# EAGLE schematic mattduino_mega (EAGLE 8.6.1)

## Sheet 1 of 4: CPU
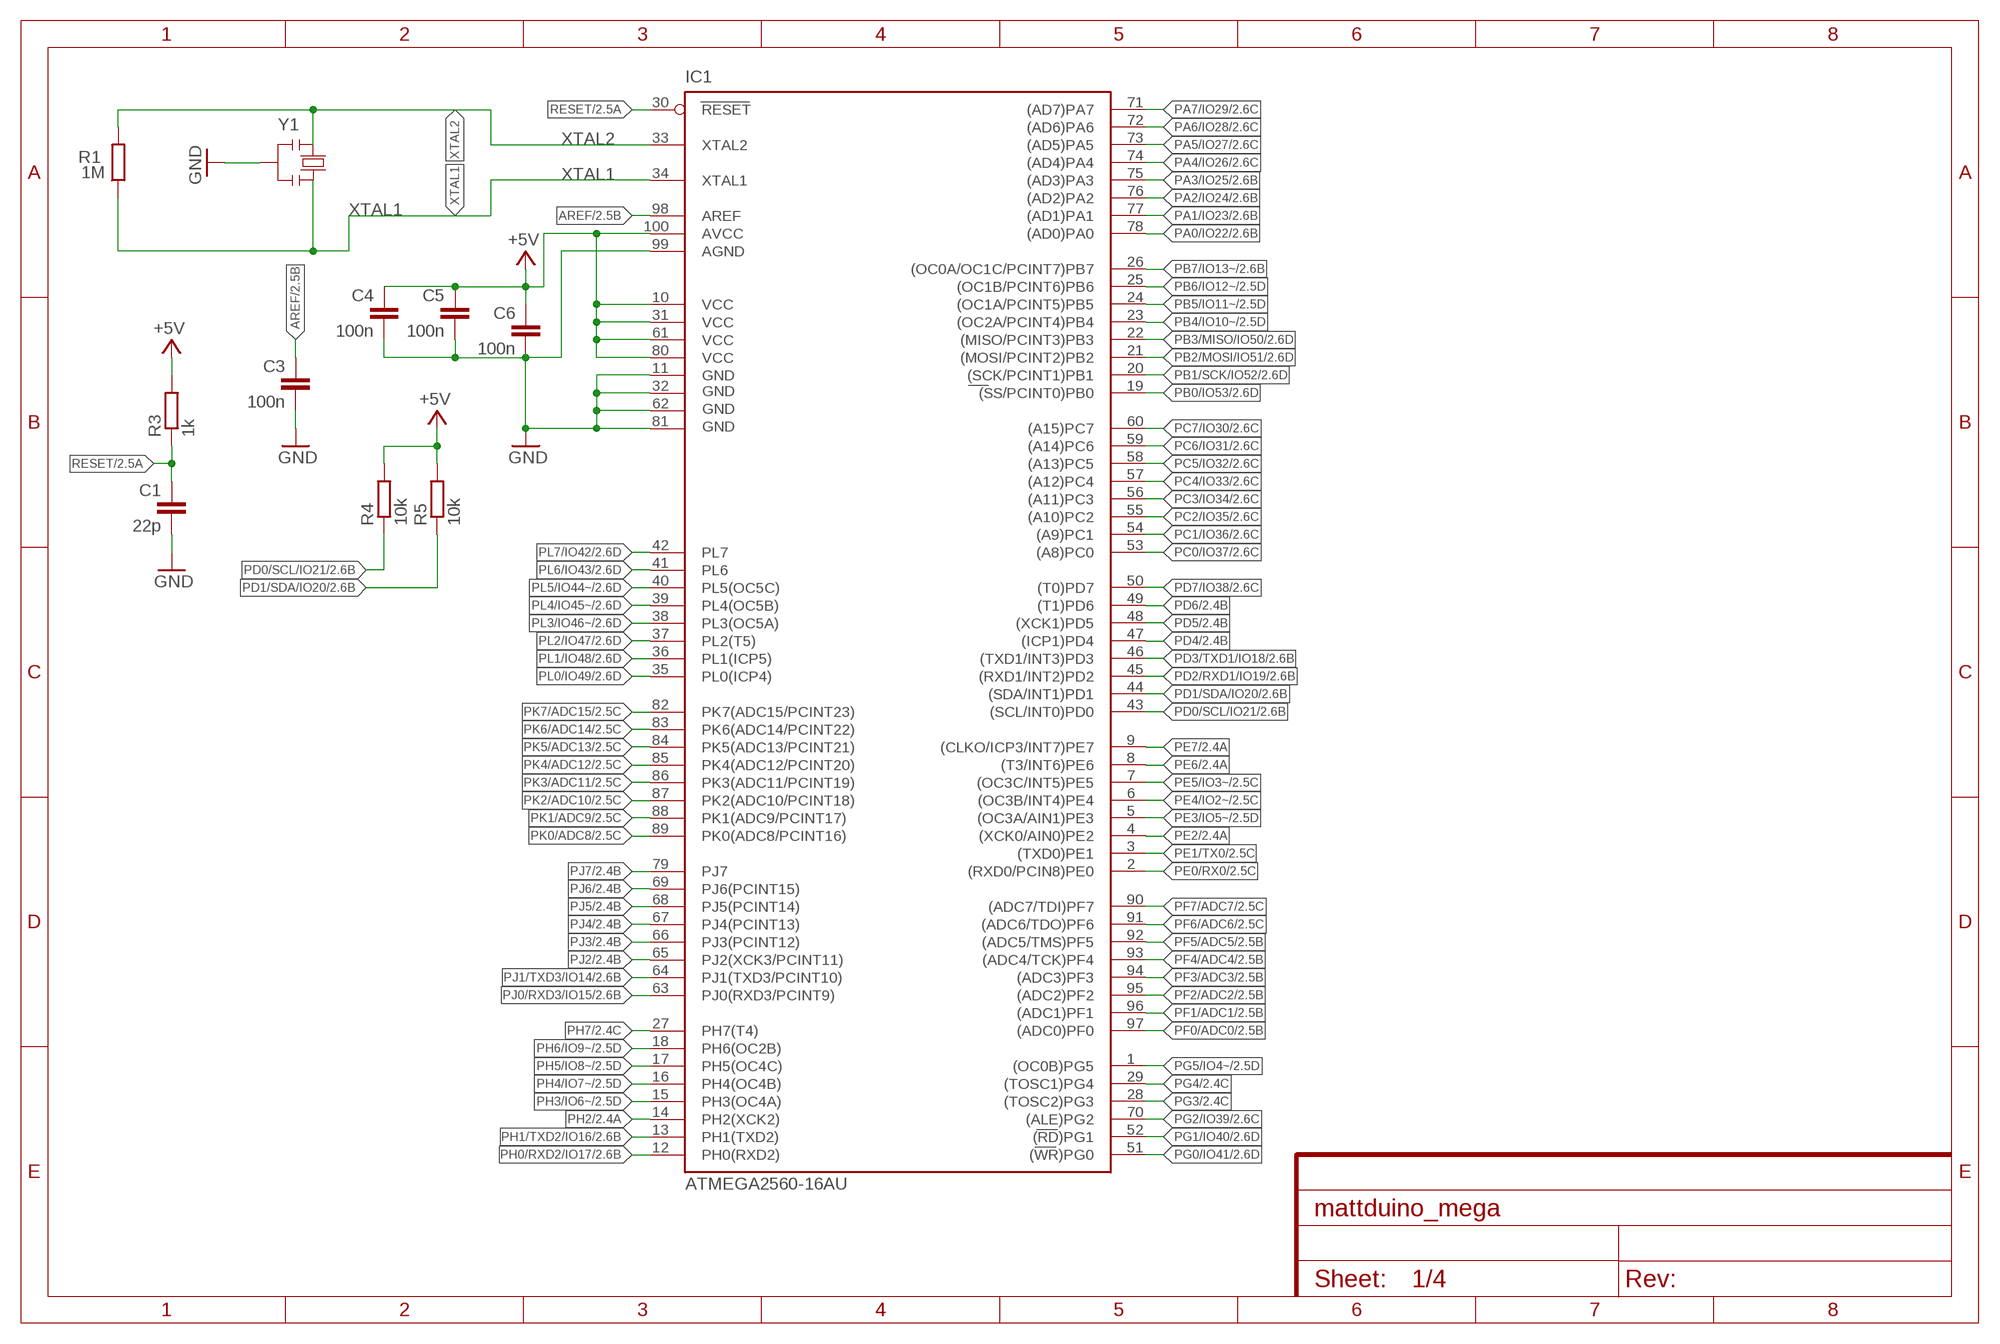
[diagram p0: schematic, sheet 1]

### Parts
C1  22p  C-EUC1206  [C1206]
C3  100n  C-EUC1206  [C1206]
C4  100n  C-EUC1206  [C1206]
C5  100n  C-EUC1206  [C1206]
C6  100n  C-EUC1206  [C1206]
IC1  ATMEGA2560-16AU  ATMEGA25602560-16AU  [TQFP100]
R1  1M  R-EU_R1206  [R1206]
R3  1k  R-EU_R1206  [R1206]
R4  10k  R-EU_R1206  [R1206]
R5  10k  R-EU_R1206  [R1206]
Y1  CSTCE16M0V53-R0 16MHZ  RESONATORMU  [RESONATOR]

### Nets
+5V [power usb]: C4.1 C5.1 C6.1 IC1.10(VCC) IC1.31(VCC1) IC1.61(VCC2) IC1.80(VCC3) IC1.100(AVCC) R3.2 R4.2 R5.2 ; also sheet 2,3,4
AREF: C3.1 IC1.98(AREF) ; also sheet 2
GND [gnd]: C1.2 C3.2 C4.2 C5.2 C6.2 IC1.11(GND) IC1.32(GND1) IC1.62(GND2) IC1.81(GND3) IC1.99(AGND) Y1.2 ; also sheet 2,3,4
PA0/IO22: IC1.78((AD0)PA0) ; also sheet 2
PA1/IO23: IC1.77((AD1)PA1) ; also sheet 2
PA2/IO24: IC1.76((AD2)PA2) ; also sheet 2
PA3/IO25: IC1.75((AD3)PA3) ; also sheet 2
PA4/IO26: IC1.74((AD4)PA4) ; also sheet 2
PA5/IO27: IC1.73((AD5)PA5) ; also sheet 2
PA6/IO28: IC1.72((AD6)PA6) ; also sheet 2
PA7/IO29: IC1.71((AD7)PA7) ; also sheet 2
PB0/IO53: IC1.19((SS/PCINT0)PB0) ; also sheet 2
PB1/SCK/IO52: IC1.20((SCK/PCINT1)PB1) ; also sheet 2
PB2/MOSI/IO51: IC1.21((MOSI/PCINT2)PB2) ; also sheet 2
PB3/MISO/IO50: IC1.22((MISO/PCINT3)PB3) ; also sheet 2
PB4/IO10~: IC1.23((OC2A/PCINT4)PB4) ; also sheet 2
PB5/IO11~: IC1.24((OC1A/PCINT5)PB5) ; also sheet 2
PB6/IO12~: IC1.25((OC1B/PCINT6)PB6) ; also sheet 2
PB7/IO13~: IC1.26((OC0A/OC1C/PCINT7)PB7) ; also sheet 2
PC0/IO37: IC1.53((A8)PC0) ; also sheet 2
PC1/IO36: IC1.54((A9)PC1) ; also sheet 2
PC2/IO35: IC1.55((A10)PC2) ; also sheet 2
PC3/IO34: IC1.56((A11)PC3) ; also sheet 2
PC4/IO33: IC1.57((A12)PC4) ; also sheet 2
PC5/IO32: IC1.58((A13)PC5) ; also sheet 2
PC6/IO31: IC1.59((A14)PC6) ; also sheet 2
PC7/IO30: IC1.60((A15)PC7) ; also sheet 2
PD0/SCL/IO21: IC1.43((SCL/INT0)PD0) R4.1 ; also sheet 2
PD1/SDA/IO20: IC1.44((SDA/INT1)PD1) R5.1 ; also sheet 2
PD2/RXD1/IO19: IC1.45((RXD1/INT2)PD2) ; also sheet 2
PD3/TXD1/IO18: IC1.46((TXD1/INT3)PD3) ; also sheet 2
PD4: IC1.47((ICP1)PD4) ; also sheet 2
PD5: IC1.48((XCK1)PD5) ; also sheet 2
PD6: IC1.49((T1)PD6) ; also sheet 2
PD7/IO38: IC1.50((T0)PD7) ; also sheet 2
PE0/RX0: IC1.2((RXD0/PCIN8)PE0) ; also sheet 2,4
PE1/TX0: IC1.3((TXD0)PE1) ; also sheet 2,4
PE2: IC1.4((XCK0/AIN0)PE2) ; also sheet 2
PE3/IO5~: IC1.5((OC3A/AIN1)PE3) ; also sheet 2
PE4/IO2~: IC1.6((OC3B/INT4)PE4) ; also sheet 2
PE5/IO3~: IC1.7((OC3C/INT5)PE5) ; also sheet 2
PE6: IC1.8((T3/INT6)PE6) ; also sheet 2
PE7: IC1.9((CLKO/ICP3/INT7)PE7) ; also sheet 2
PF0/ADC0: IC1.97((ADC0)PF0) ; also sheet 2
PF1/ADC1: IC1.96((ADC1)PF1) ; also sheet 2
PF2/ADC2: IC1.95((ADC2)PF2) ; also sheet 2
PF3/ADC3: IC1.94((ADC3)PF3) ; also sheet 2
PF4/ADC4: IC1.93((ADC4/TCK)PF4) ; also sheet 2
PF5/ADC5: IC1.92((ADC5/TMS)PF5) ; also sheet 2
PF6/ADC6: IC1.91((ADC6/TDO)PF6) ; also sheet 2
PF7/ADC7: IC1.90((ADC7/TDI)PF7) ; also sheet 2
PG0/IO41: IC1.51((WR)PG0) ; also sheet 2
PG1/IO40: IC1.52((RD)PG1) ; also sheet 2
PG2/IO39: IC1.70((ALE)PG2) ; also sheet 2
PG3: IC1.28((TOSC2)PG3) ; also sheet 2
PG4: IC1.29((TOSC1)PG4) ; also sheet 2
PG5/IO4~: IC1.1((OC0B)PG5) ; also sheet 2
PH0/RXD2/IO17: IC1.12(PH0(RXD2)) ; also sheet 2
PH1/TXD2/IO16: IC1.13(PH1(TXD2)) ; also sheet 2
PH2: IC1.14(PH2(XCK2)) ; also sheet 2
PH3/IO6~: IC1.15(PH3(OC4A)) ; also sheet 2
PH4/IO7~: IC1.16(PH4(OC4B)) ; also sheet 2
PH5/IO8~: IC1.17(PH5(OC4C)) ; also sheet 2
PH6/IO9~: IC1.18(PH6(OC2B)) ; also sheet 2
PH7: IC1.27(PH7(T4)) ; also sheet 2
PJ0/RXD3/IO15: IC1.63(PJ0(RXD3/PCINT9)) ; also sheet 2
PJ1/TXD3/IO14: IC1.64(PJ1(TXD3/PCINT10)) ; also sheet 2
PJ2: IC1.65(PJ2(XCK3/PCINT11)) ; also sheet 2
PJ3: IC1.66(PJ3(PCINT12)) ; also sheet 2
PJ4: IC1.67(PJ4(PCINT13)) ; also sheet 2
PJ5: IC1.68(PJ5(PCINT14)) ; also sheet 2
PJ6: IC1.69(PJ6(PCINT15)) ; also sheet 2
PJ7: IC1.79(PJ7) ; also sheet 2
PK0/ADC8: IC1.89(PK0(ADC8/PCINT16)) ; also sheet 2
PK1/ADC9: IC1.88(PK1(ADC9/PCINT17)) ; also sheet 2
PK2/ADC10: IC1.87(PK2(ADC10/PCINT18)) ; also sheet 2
PK3/ADC11: IC1.86(PK3(ADC11/PCINT19)) ; also sheet 2
PK4/ADC12: IC1.85(PK4(ADC12/PCINT20)) ; also sheet 2
PK5/ADC13: IC1.84(PK5(ADC13/PCINT21)) ; also sheet 2
PK6/ADC14: IC1.83(PK6(ADC14/PCINT22)) ; also sheet 2
PK7/ADC15: IC1.82(PK7(ADC15/PCINT23)) ; also sheet 2
PL0/IO49: IC1.35(PL0(ICP4)) ; also sheet 2
PL1/IO48: IC1.36(PL1(ICP5)) ; also sheet 2
PL2/IO47: IC1.37(PL2(T5)) ; also sheet 2
PL3/IO46~: IC1.38(PL3(OC5A)) ; also sheet 2
PL4/IO45~: IC1.39(PL4(OC5B)) ; also sheet 2
PL5/IO44~: IC1.40(PL5(OC5C)) ; also sheet 2
PL6/IO43: IC1.41(PL6) ; also sheet 2
PL7/IO42: IC1.42(PL7) ; also sheet 2
RESET: C1.1 IC1.30(RESET) R3.1 ; also sheet 2,4
XTAL1: IC1.34(XTAL1) R1.1 Y1.3
XTAL2: IC1.33(XTAL2) R1.2 Y1.1

## Sheet 2 of 4: PINOUT
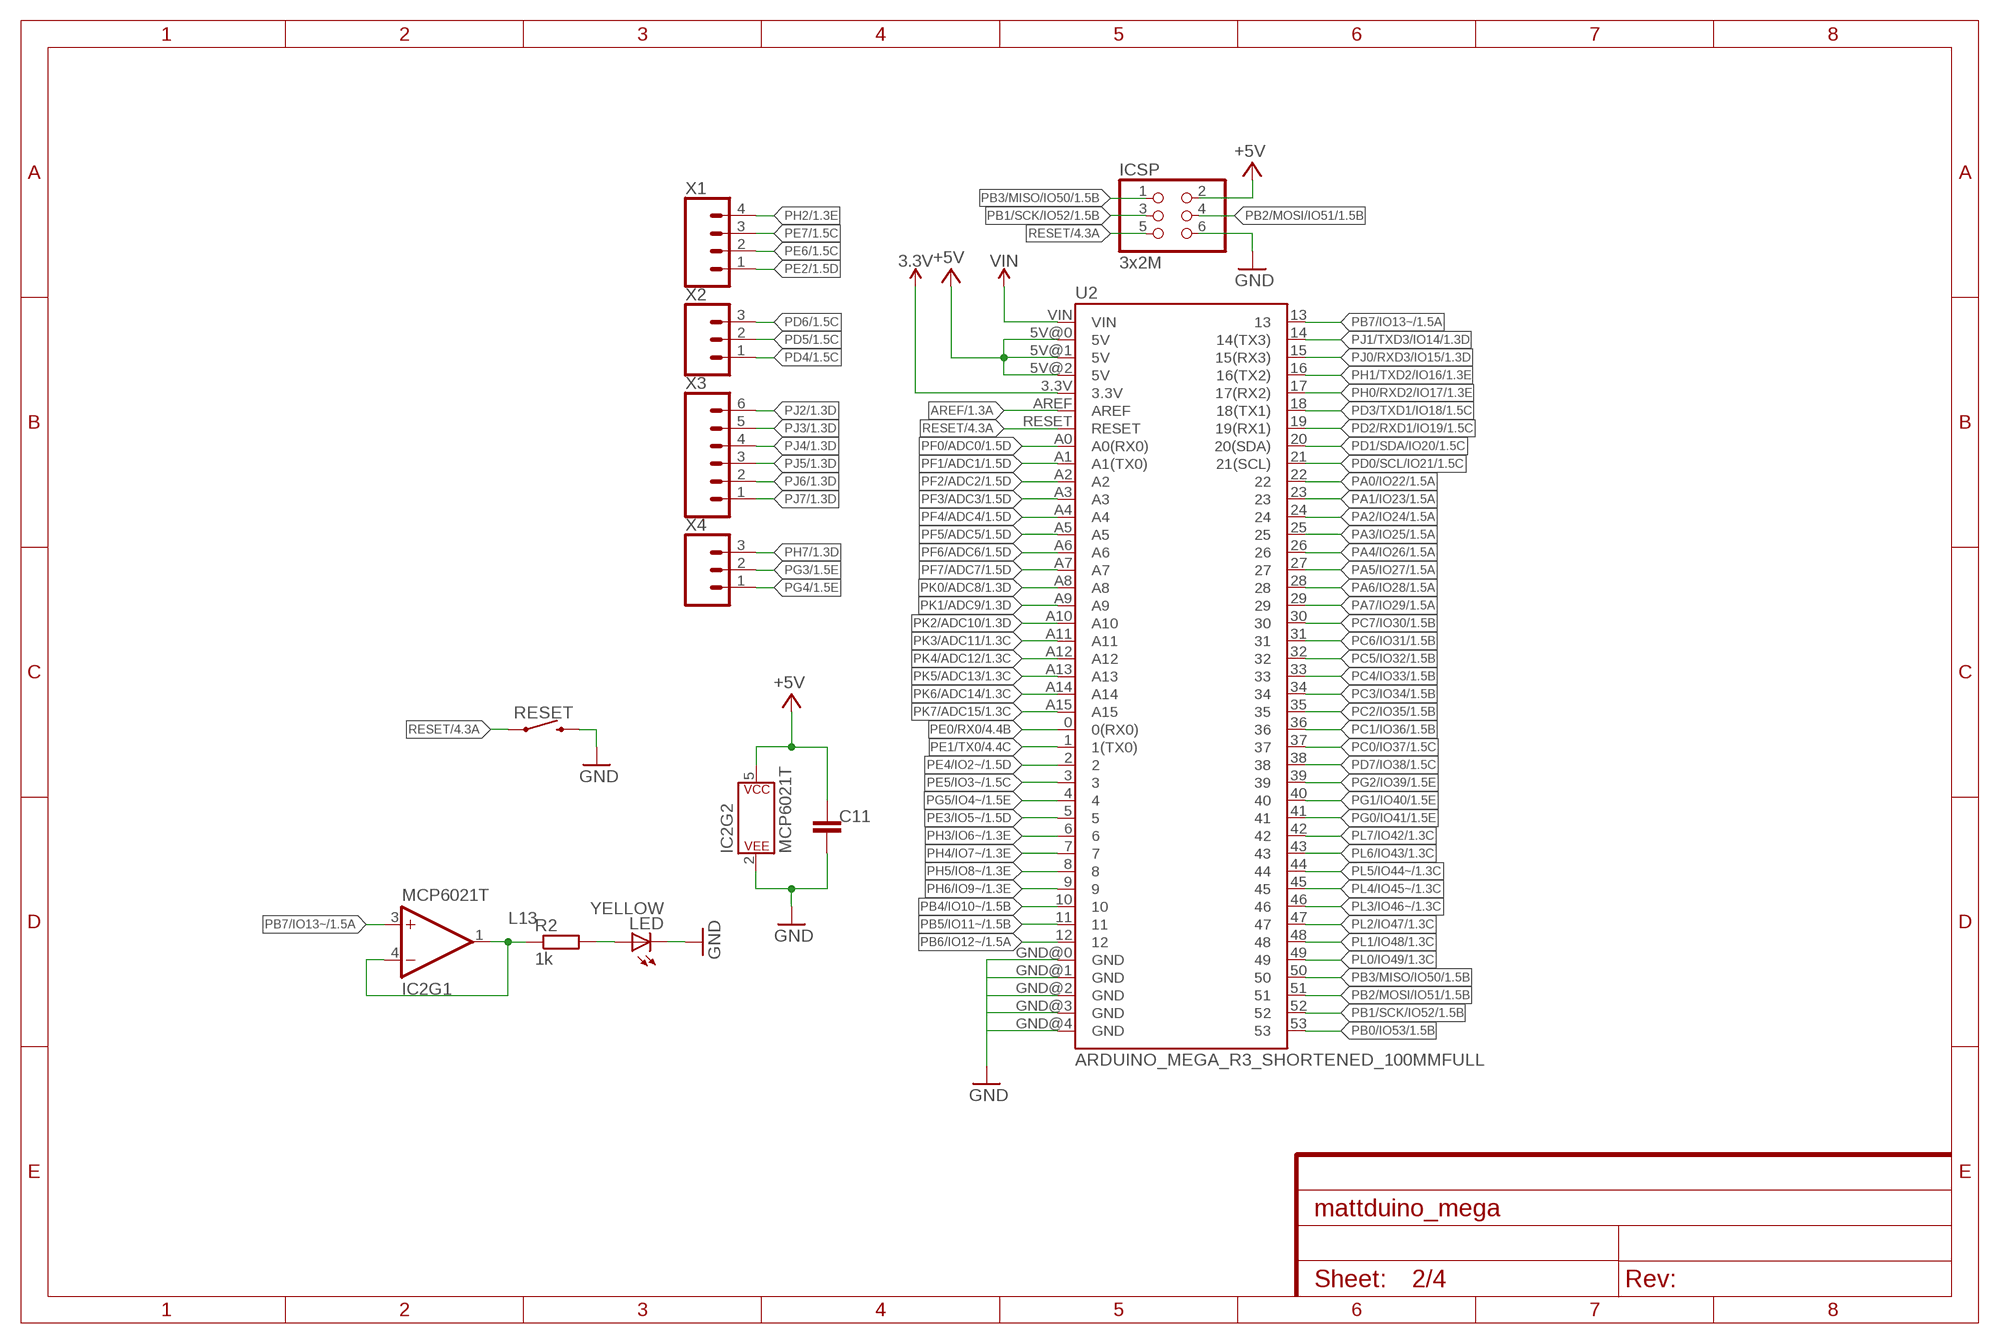
[diagram p1: schematic, sheet 2]

### Parts
C11  100n  C-EUC1206  [C1206]
IC2  MCP6021T  MCP6021T-E/OT  [SOT23-5]
ICSP  3x2M  PINHD-2X3  [2X03]
LED  YELLOW  LEDCHIP-LED0805  [CHIP-LED0805]
R2  1k  R-EU_R1206  [R1206]
RESET  MOMENTARY-SWITCH-SPST-PTH-6.0MM  [TACTILE_SWITCH_PTH_6.0MM]
U2  ARDUINO_MEGA_R3_SHORTENED_100MMFULL  [ARDUINO_MEGA_SHORTENED_100MM]
X1  CONN_04  [1X04]
X2  CONN_03  [1X03]
X3  CONN_06SILK_FEMALE_PTH  [1X06]
X4  CONN_03  [1X03]

### Nets
3.3V: U2.3.3V ; also sheet 3,4
+5V [power usb]: C11.2 IC2.5(P$V+) ICSP.2 U2.5V@0(5V) U2.5V@1(5V) U2.5V@2(5V) ; also sheet 1,3,4
AREF: U2.AREF ; also sheet 1
GND [gnd]: C11.1 IC2.2(P$V-) ICSP.6 LED.C RESET.3 U2.GND@0(GND) U2.GND@1(GND) U2.GND@2(GND) U2.GND@3(GND) U2.GND@4(GND) ; also sheet 1,3,4
L13: IC2.1(OUT) IC2.4(-IN) R2.1
N$2: LED.A R2.2
PA0/IO22: U2.22 ; also sheet 1
PA1/IO23: U2.23 ; also sheet 1
PA2/IO24: U2.24 ; also sheet 1
PA3/IO25: U2.25 ; also sheet 1
PA4/IO26: U2.26 ; also sheet 1
PA5/IO27: U2.27 ; also sheet 1
PA6/IO28: U2.28 ; also sheet 1
PA7/IO29: U2.29 ; also sheet 1
PB0/IO53: U2.53 ; also sheet 1
PB1/SCK/IO52: ICSP.3 U2.52 ; also sheet 1
PB2/MOSI/IO51: ICSP.4 U2.51 ; also sheet 1
PB3/MISO/IO50: ICSP.1 U2.50 ; also sheet 1
PB4/IO10~: U2.10 ; also sheet 1
PB5/IO11~: U2.11 ; also sheet 1
PB6/IO12~: U2.12 ; also sheet 1
PB7/IO13~: IC2.3(+IN) U2.13 ; also sheet 1
PC0/IO37: U2.37 ; also sheet 1
PC1/IO36: U2.36 ; also sheet 1
PC2/IO35: U2.35 ; also sheet 1
PC3/IO34: U2.34 ; also sheet 1
PC4/IO33: U2.33 ; also sheet 1
PC5/IO32: U2.32 ; also sheet 1
PC6/IO31: U2.31 ; also sheet 1
PC7/IO30: U2.30 ; also sheet 1
PD0/SCL/IO21: U2.21(21(SCL)) ; also sheet 1
PD1/SDA/IO20: U2.20(20(SDA)) ; also sheet 1
PD2/RXD1/IO19: U2.19(19(RX1)) ; also sheet 1
PD3/TXD1/IO18: U2.18(18(TX1)) ; also sheet 1
PD4: X2.1 ; also sheet 1
PD5: X2.2 ; also sheet 1
PD6: X2.3 ; also sheet 1
PD7/IO38: U2.38 ; also sheet 1
PE0/RX0: U2.0(0(RX0)) ; also sheet 1,4
PE1/TX0: U2.1(1(TX0)) ; also sheet 1,4
PE2: X1.1 ; also sheet 1
PE3/IO5~: U2.5 ; also sheet 1
PE4/IO2~: U2.2 ; also sheet 1
PE5/IO3~: U2.3 ; also sheet 1
PE6: X1.2 ; also sheet 1
PE7: X1.3 ; also sheet 1
PF0/ADC0: U2.A0(A0(RX0)) ; also sheet 1
PF1/ADC1: U2.A1(A1(TX0)) ; also sheet 1
PF2/ADC2: U2.A2 ; also sheet 1
PF3/ADC3: U2.A3 ; also sheet 1
PF4/ADC4: U2.A4 ; also sheet 1
PF5/ADC5: U2.A5 ; also sheet 1
PF6/ADC6: U2.A6 ; also sheet 1
PF7/ADC7: U2.A7 ; also sheet 1
PG0/IO41: U2.41 ; also sheet 1
PG1/IO40: U2.40 ; also sheet 1
PG2/IO39: U2.39 ; also sheet 1
PG3: X4.2 ; also sheet 1
PG4: X4.1 ; also sheet 1
PG5/IO4~: U2.4 ; also sheet 1
PH0/RXD2/IO17: U2.17(17(RX2)) ; also sheet 1
PH1/TXD2/IO16: U2.16(16(TX2)) ; also sheet 1
PH2: X1.4 ; also sheet 1
PH3/IO6~: U2.6 ; also sheet 1
PH4/IO7~: U2.7 ; also sheet 1
PH5/IO8~: U2.8 ; also sheet 1
PH6/IO9~: U2.9 ; also sheet 1
PH7: X4.3 ; also sheet 1
PJ0/RXD3/IO15: U2.15(15(RX3)) ; also sheet 1
PJ1/TXD3/IO14: U2.14(14(TX3)) ; also sheet 1
PJ2: X3.6 ; also sheet 1
PJ3: X3.5 ; also sheet 1
PJ4: X3.4 ; also sheet 1
PJ5: X3.3 ; also sheet 1
PJ6: X3.2 ; also sheet 1
PJ7: X3.1 ; also sheet 1
PK0/ADC8: U2.A8 ; also sheet 1
PK1/ADC9: U2.A9 ; also sheet 1
PK2/ADC10: U2.A10 ; also sheet 1
PK3/ADC11: U2.A11 ; also sheet 1
PK4/ADC12: U2.A12 ; also sheet 1
PK5/ADC13: U2.A13 ; also sheet 1
PK6/ADC14: U2.A14 ; also sheet 1
PK7/ADC15: U2.A15 ; also sheet 1
PL0/IO49: U2.49 ; also sheet 1
PL1/IO48: U2.48 ; also sheet 1
PL2/IO47: U2.47 ; also sheet 1
PL3/IO46~: U2.46 ; also sheet 1
PL4/IO45~: U2.45 ; also sheet 1
PL5/IO44~: U2.44 ; also sheet 1
PL6/IO43: U2.43 ; also sheet 1
PL7/IO42: U2.42 ; also sheet 1
RESET: ICSP.5 RESET.1 U2.RESET ; also sheet 1,4
VIN: U2.VIN ; also sheet 3

## Sheet 3 of 4: Power
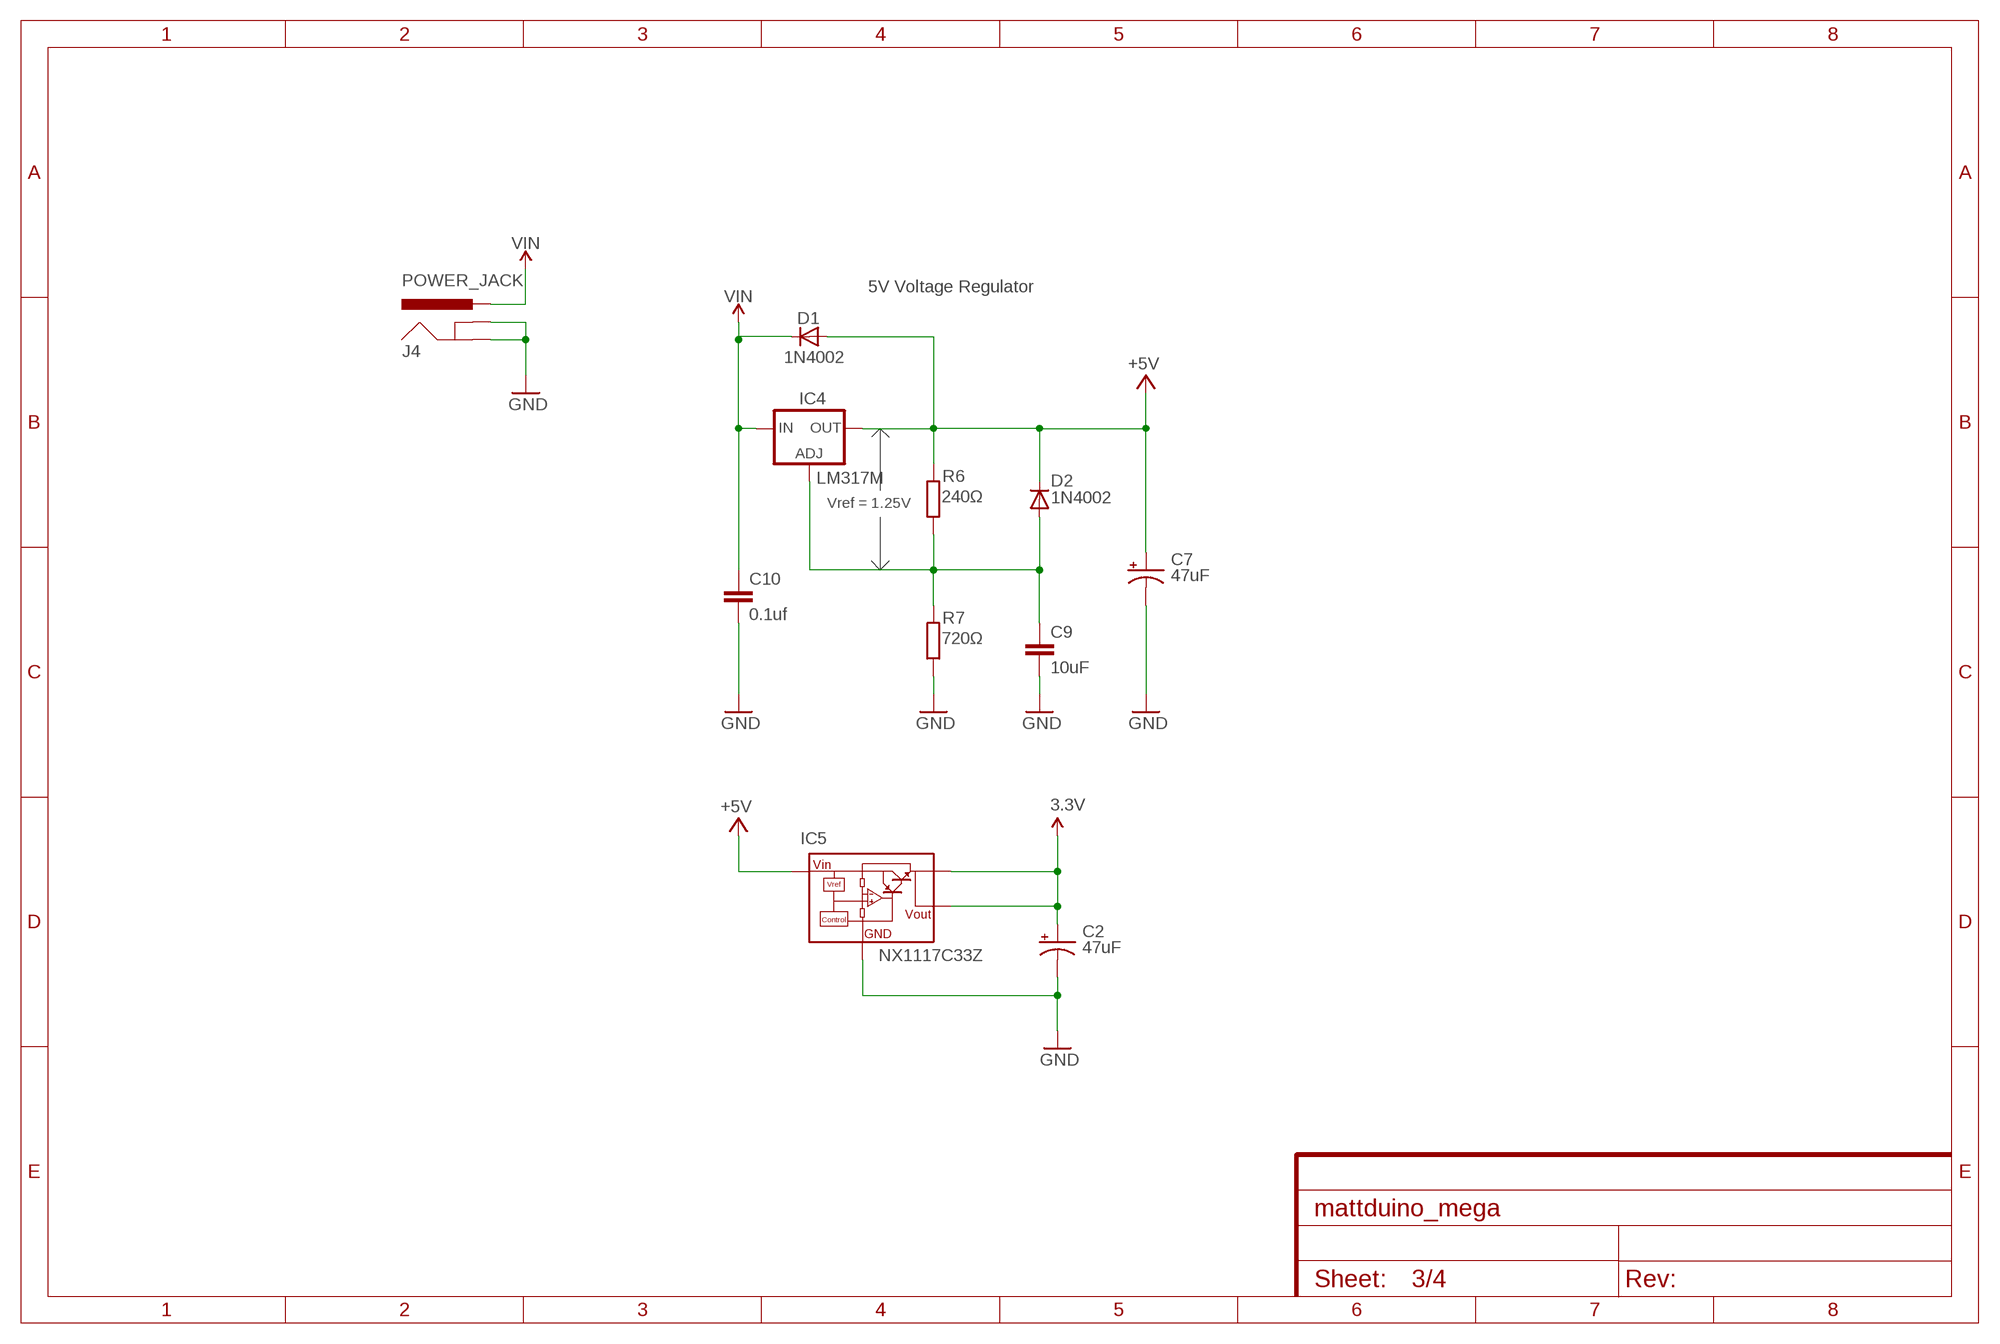
[diagram p2: schematic, sheet 3]

### Parts
C2  47uF  47UF-POLAR-PANASONIC_D-35V-20%  [PANASONIC_D]
C7  47uF  47UF-POLAR-PANASONIC_D-35V-20%  [PANASONIC_D]
C9  10uF  C-EUC1206  [C1206]
C10  0.1uf  C-EUC1206  [C1206]
D1  1N4002  DIODESOD-123  [SOD-123]
D2  1N4002  DIODESOD-123  [SOD-123]
IC4  LM317MBSTT3  [SOT223]
IC5  NX1117C33Z  [SOT223]
J4  POWER_JACK  [POWER_JACK_PTH]
R6  240Ω  R-EU_R1206  [R1206]
R7  720Ω  R-EU_R1206  [R1206]

### Nets
3.3V: C2.+ IC5.2(VOUT1) IC5.4(VOUT) ; also sheet 2,4
+5V [power usb]: C7.+ D1.A D2.C IC4.4(OUT) IC5.3(VIN) R6.2 ; also sheet 1,2,4
GND [gnd]: C2.- C7.- C9.2 C10.2 IC5.1(GND) J4.GND J4.GNDBREAK R7.1 ; also sheet 1,2,4
N$1: C9.1 D2.A IC4.1(ADJ) R6.1 R7.2
VIN: C10.1 D1.C IC4.3(IN) J4.PWR ; also sheet 2

### Notes on the sheet
- 5V Voltage Regulator
- Vref = 1.25V

## Sheet 4 of 4: Programmer
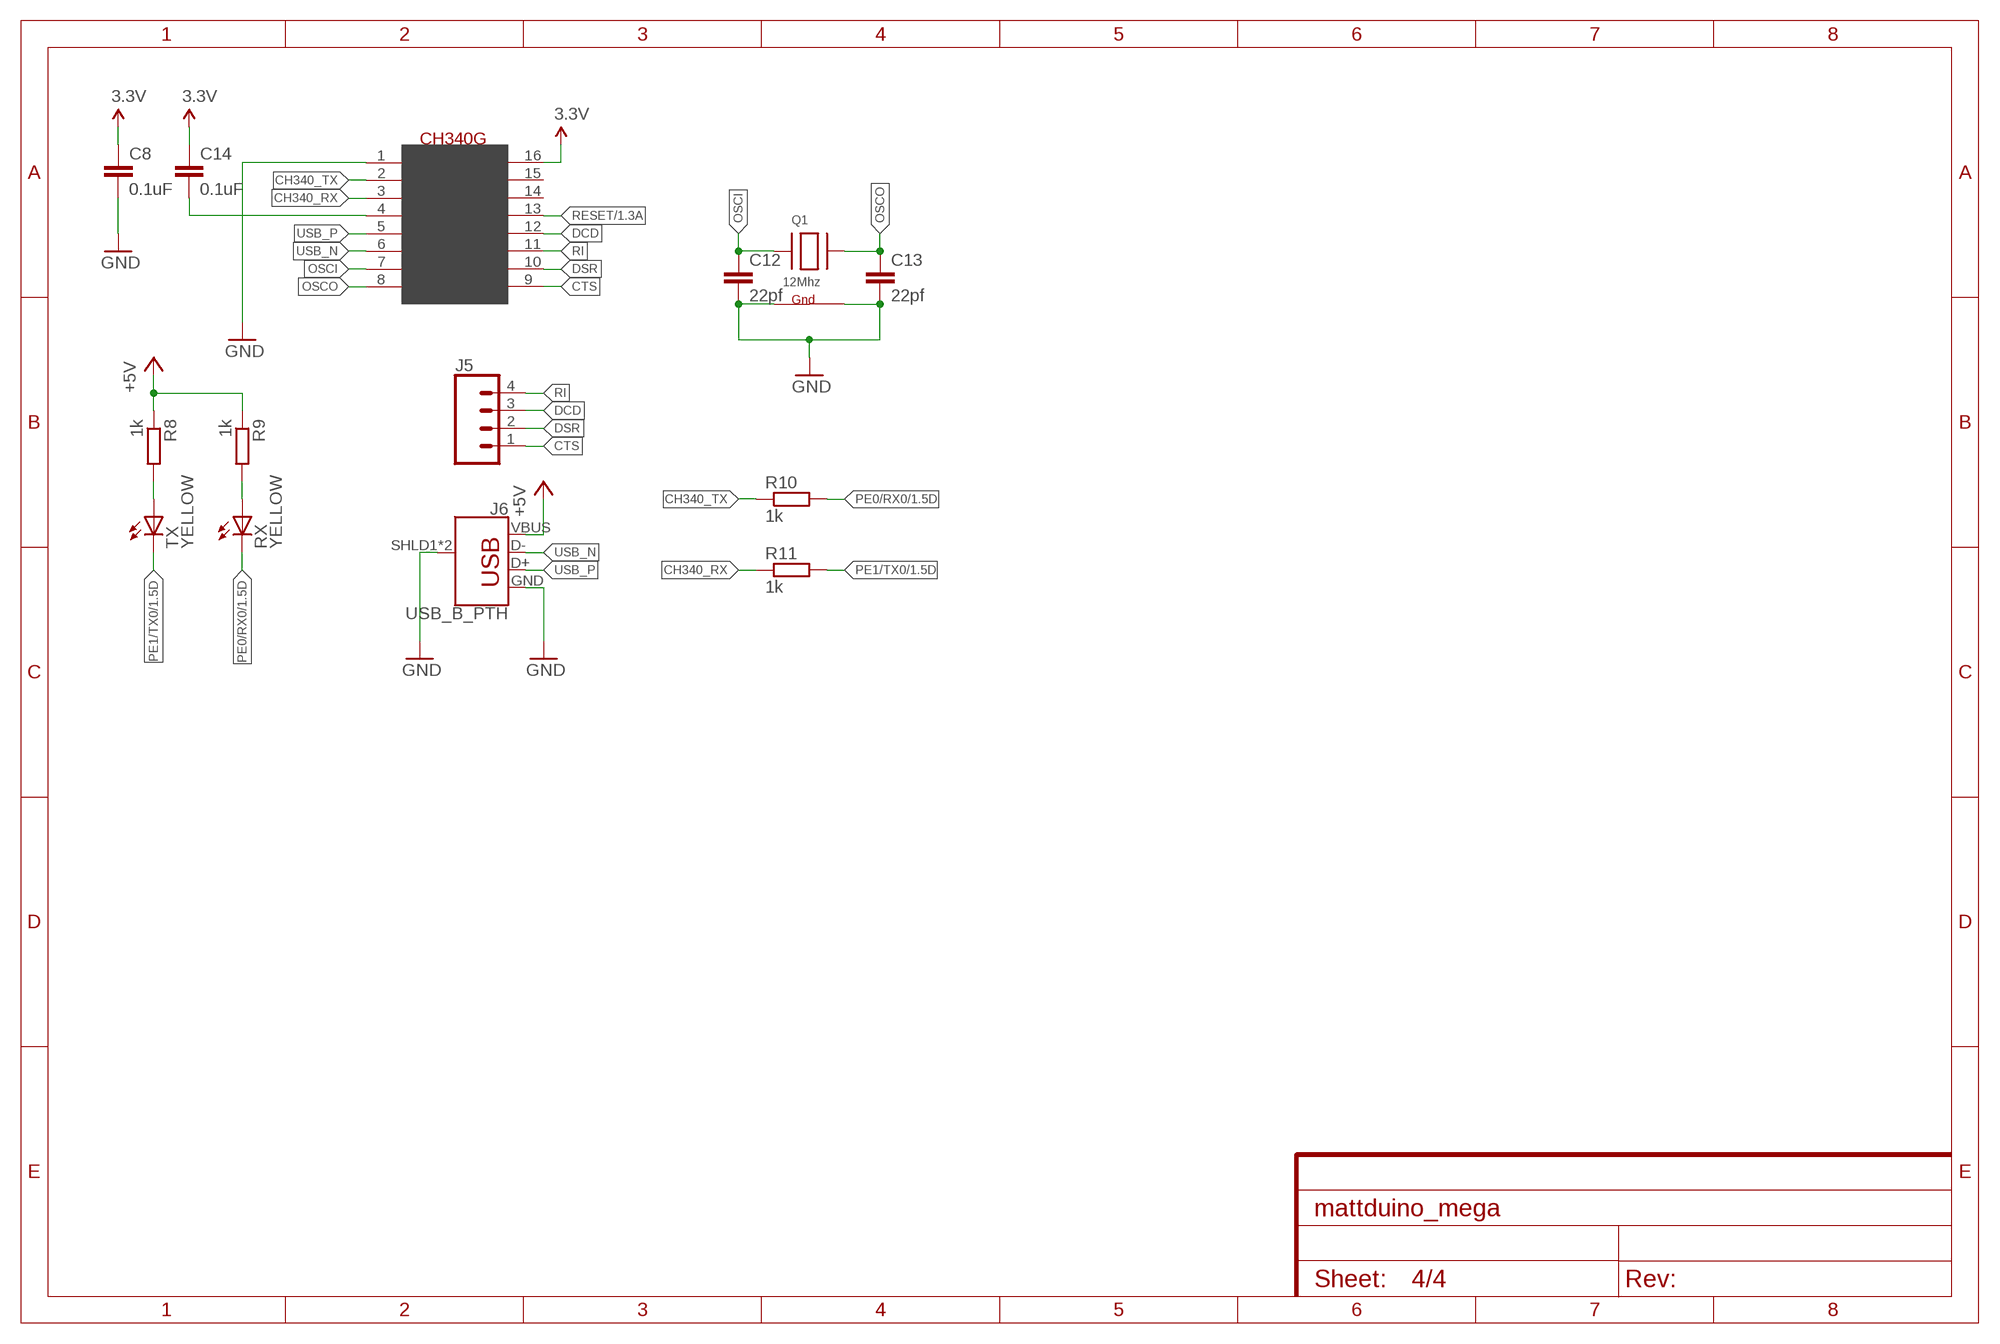
[diagram p3: schematic, sheet 4]

### Parts
C8  0.1uF  C-EUC1206  [C1206]
C12  22pf  C-EUC1206  [C1206]
C13  22pf  C-EUC1206  [C1206]
C14  0.1uF  C-EUC1206  [C1206]
IC3  CH340G  [SOIC16]
J5  CONN_04  [1X04]
J6  USB_B_PTH  [USB-B-PTH]
Q1  12Mhz  XTAL-4-3225  [NX3225]
R8  1k  R-EU_R1206  [R1206]
R9  1k  R-EU_R1206  [R1206]
R10  1k  R-EU_R1206  [R1206]
R11  1k  R-EU_R1206  [R1206]
RX  YELLOW  LEDCHIP-LED0805  [CHIP-LED0805]
TX  YELLOW  LEDCHIP-LED0805  [CHIP-LED0805]

### Nets
3.3V: C8.1 C14.1 IC3.16(VCC) ; also sheet 2,3
+5V [power usb]: J6.VBUS R8.1 R9.1 ; also sheet 1,2,3
CH340_RX: IC3.3(RX) R11.1
CH340_TX: IC3.2(TX) R10.1
CTS: IC3.9(CTS) J5.1
DCD: IC3.12(DCD) J5.3
DSR: IC3.10(DSR) J5.2
GND [gnd]: C8.2 C12.2 C13.2 IC3.1(GND) J6.GND J6.SHLD1(SHIELD) J6.SHLD2(SHIELD) Q1.2(G2) Q1.4(G1) ; also sheet 1,2,3
N$3: C14.2 IC3.4(V3)
N$5: R8.2 TX.A
N$6: R9.2 RX.A
OSCI: C12.1 IC3.7(XI) Q1.1(X1)
OSCO: C13.1 IC3.8(XO) Q1.3(X2)
PE0/RX0: R10.2 RX.C ; also sheet 1,2
PE1/TX0: R11.2 TX.C ; also sheet 1,2
RESET: IC3.13(DTR) ; also sheet 1,2
RI: IC3.11(RI) J5.4
USB_N: IC3.6(D-) J6.D-
USB_P: IC3.5(D+) J6.D+
Unconnected: IC3.14(RTS) IC3.15(RS232)

## Library data of the parts
C1 C3-C6 C8-C11 C14 = rcl:C-EU: CAPACITOR, European symbol; SPICEPREFIX: C
C2 C7 = SparkFun-Capacitors:47UF-POLAR: 47µF polarized capacitors A capacitor is a passive two-terminal electrical component used to store electrical energy temporarily in an electric field.; PROD_ID: CAP-08478
C12 C13 = rcl:C-EU: CAPACITOR, European symbol
D1 D2 = adafruit:DIODE: Diode SMADIODE - SMA Surface Mount Package 20V 1A Schottky Diode Digikey: 641-1014-6-ND DO-1N4148 - Through Hole Small Current Diode SOD-123 20V 1 A (.5mV Vf) Schottky Diode - Digikey: MBRX120TPMSCT-ND SOD-323 10V 570mA (.38mV Vf, 3ns) Schottky Diode - Digikey: ZLLS410CT-ND SOD-523 30V 30mA Schottky Diode (RB751S-40TE61) - Digikey: RB751S-40TE61CT-ND SOT23-R/W - SOT23 Package (R = Solder Paste/Reflow Ovens, W = Hand-Soldering) BAT54Film 40V 300mA - Digikey: 497-7162-1-ND
IC1 = SmartPrj:ATMEGA2560: MICROCONTROLLER 64/128/256 Kbytes FLASH 4 Kbytes EEPROM 8 Kbytes SRAM 86 General Purpose I/O pins 12-channels16-bit PWM 4 x Serial USARTs 16-channels 10-bit A/D
IC2 = SparkFun-IC-Amplifiers:MCP6021: MCP6021T-E/OT OP AMP Rail-to-rail input/output op-amp with 10 MHz bandwidth. SparkFun Products ZX Distance and Gesture Sensor <https://www.sparkfun.com/products/12780> (SEN-12780); PROD_ID: IC-12504
IC3 = CH340G-USB-SERIAL:CH340G
IC4 = v-reg:LM317?*: 500 mA Adjustable Output Positive Voltage Regulator Source: http://www.onsemi.co.jp .. LM317M-D.PDF; PARTNUMBER: LM317M
IC5 = nxp_60:NX1117C: The NX1117C/NX1117CE are two series of low-dropout positive voltage regulators with an output current capability of 1 A. AAL Eindhoven MK; 12NC: 9352 914 42115; TOLERANCE: 1.25%; VOLTAGE: 5.0V
ICSP = SmartPrj:PINHD-2X3: PIN HEADER
J4 = SparkFun-Connectors:POWER_JACK: Power Jack Connector This is the standard 5.5mm barrel jack for power. The PTH is the most common, proven, reliable, footprint. The Slot footprint only works if the mill layer is transmitted to the PCB fab house so be warned. Here are the connectors we sell at SparkFun: DC Barrel Power Jack/Connector <https://www.sparkfun.com/products/119> (PRT-00119) DC Barrel Power Jack/Connector (SMD) <https://www.sparkfun.com/products/12748> (PRT-12748) DC Barrel Jack Adapter - Breadboard Compatible <https://www.sparkfun.com/products/10811> (PRT-10811) It is used on this SparkFun product (and many, many others): SparkFun RedBoard - Programmed with Arduino <https://www.sparkfun.com/products/12757> (DEV-12757) Also, if you need a mating power supply or connector, please check these out: Wall Adapter Power Supply - 9VDC 650mA <https://www.sparkfun.com/products/298> (TOL-00298) DC Barrel Jack Adapter - Male <https://www.sparkfun.com/products/10287> (PRT-10287); PROD_ID: CONN-08197
J5 X1 = SparkFun-Connectors:CONN_04: Multi connection point. Often used as Generic Header-pin footprint for 0.1 inch spaced/style header connections On any of the 0.1 inch spaced packages, you can populate with these: Break Away Headers - Straight <https://www.sparkfun.com/products/116> (PRT-00116) Break Away Male Headers - Right Angle <https://www.sparkfun.com/products/553> (PRT-00553) Female Headers <https://www.sparkfun.com/products/115> (PRT-00115) Break Away Headers - Machine Pin <https://www.sparkfun.com/products/117> (PRT-00117) Break Away Female Headers - Swiss Machine Pin <https://www.sparkfun.com/products/743> (PRT-00743) For SCREWTERMINALS and SPRING TERMINALS visit here: Screw Terimnals on SparkFun.com <https://www.sparkfun.com/search/results?term=Screw+Terminals> (5mm/3.5mm/2.54mm spacing) This device is also useful as a general connection point to wire up your design to another part of your project. Our various solder wires solder well into these plated through hole pads. Hook-Up Wire - Assortment (Stranded, 22 AWG) <https://www.sparkfun.com/products/11375> (PRT-11375) Hook-Up Wire - Assortment (Solid Core, 22 AWG) <https://www.sparkfun.com/products/11367> (PRT-11367) View the entire wire category on our website here <https://www.sparkfun.com/categories/141> Special notes: Molex polarized connector foot print use with SKU : PRT-08231 with associated crimp pins and housings. 1MM SMD Version SKU: PRT-10208; PROD_ID: CONN-09696
J6 = SparkFun-Connectors:USB_B: USB Type B Connector SparkFun Products: SparkFun Stepoko <https://www.sparkfun.com/products/13899> PTH; PROD_ID: CONN-08278; SF_ID: PRT-00139
LED RX TX = led:LED: LED OSRAM: - CHIPLED LG R971, LG N971, LY N971, LG Q971, LY Q971, LO R971, LY R971 LH N974, LH R974 LS Q976, LO Q976, LY Q976 LO Q996 - Hyper CHIPLED LW Q18S LB Q993, LB Q99A, LB R99A - SideLED LS A670, LO A670, LY A670, LG A670, LP A670 LB A673, LV A673, LT A673, LW A673 LH A674 LY A675 LS A676, LA A676, LO A676, LY A676, LW A676 LS A679, LY A679, LG A679 - Hyper Micro SIDELED® LS Y876, LA Y876, LO Y876, LY Y876 LT Y87S - SmartLED LW L88C, LW L88S LB L89C, LB L89S, LG L890 LS L89K, LO L89K, LY L89K LS L896, LA L896, LO L896, LY L896 - TOPLED LS T670, LO T670, LY T670, LG T670, LP T670 LSG T670, LSP T670, LSY T670, LOP T670, LYG T670 LG T671, LOG T671, LSG T671 LB T673, LV T673, LT T673, LW T673 LH T674 LS T676, LA T676, LO T676, LY T676, LB T676, LH T676, LSB T676, LW T676 LB T67C, LV T67C, LT T67C, LS T67K, LO T67K, LY T67K, LW E67C LS E67B, LA E67B, LO E67B, LY E67B, LB E67C, LV E67C, LT E67C LW T67C LS T679, LY T679, LG T679 LS T770, LO T770, LY T770, LG T770, LP T770 LB T773, LV T773, LT T773, LW T773 LH T774 LS E675, LA E675, LY E675, LS T675 LS T776, LA T776, LO T776, LY T776, LB T776 LHGB T686 LT T68C, LB T68C - Hyper Mini TOPLED® LB M676 - Mini TOPLED Santana® LG M470 LS M47K, LO M47K, LY M47K Source: http://www.osram.convergy.de LUXEON: - LUMILED® LXK2-PW12-R00, LXK2-PW12-S00, LXK2-PW14-U00, LXK2-PW14-V00 LXK2-PM12-R00, LXK2-PM12-S00, LXK2-PM14-U00 LXK2-PE12-Q00, LXK2-PE12-R00, LXK2-PE12-S00, LXK2-PE14-T00, LXK2-PE14-U00 LXK2-PB12-K00, LXK2-PB12-L00, LXK2-PB12-M00, LXK2-PB14-N00, LXK2-PB14-P00, LXK2-PB14-Q00 LXK2-PR12-L00, LXK2-PR12-M00, LXK2-PR14-Q00, LXK2-PR14-R00 LXK2-PD12-Q00, LXK2-PD12-R00, LXK2-PD12-S00 LXK2-PH12-R00, LXK2-PH12-S00 LXK2-PL12-P00, LXK2-PL12-Q00, LXK2-PL12-R00 Source: www.luxeon.com KINGBRIGHT: KA-3528ASYC Source: www.kingbright.com
Q1 = adafruit:XTAL-4: Classic 4-pin 3.2 x 2.5mm crystal
R1-R11 = rcl:R-EU_: RESISTOR, European symbol; SPICEPREFIX: R
RESET = SparkFun-Switches:MOMENTARY-SWITCH-SPST: Momentary Switch (Pushbutton) - SPST Normally-open (NO) SPST momentary switches (buttons, pushbuttons). Variants PTH-12MM - 12mm square, through-hole Momentary Pushbutton Switch - 12mm Square <https://www.sparkfun.com/products/9190> (COM-09190) PTH-6.0MM, PTH-6.0MM-KIT - 6.0mm square, through-hole Mini Pushbutton Switch <https://www.sparkfun.com/products/97> (COM-00097) KIT package intended for soldering kit's - only one side of pads' copper is exposed. PTH-RIGHT-ANGLE-KIT - Right-angle, through-hole Right Angle Tactile Button <https://www.sparkfun.com/products/10791> - Used on SparkFun BigTime Watch Kit <https://www.sparkfun.com/products/11734> SMD-12MM - 12mm square, surface-mount Tactile Button - SMD (12mm) <https://www.sparkfun.com/products/12993> (COM-12993) Used on SparkFun PicoBoard <https://www.sparkfun.com/products/11888> SMD-4.5MM - 4.5mm Square Trackball Switch Used on SparkFun Blackberry Trackballer Breakout <https://www.sparkfun.com/products/13169> SMD-4.6MMX2.8MM - 4.60mm x 2.80mm, surface mount Used on SparkFun SAMD21 Mini Breakout <https://www.sparkfun.com/products/13664> SMD-5.2MM, SMD-5.2-REDUNDANT - 5.2mm square, surface-mount Mini Pushbutton Switch - SMD <https://www.sparkfun.com/products/8720> (COM-08720) Used on Arduino Pro Mini <https://www.sparkfun.com/products/11114> REDUNDANT package connects both switch circuits together SMD-6.0X3.5MM - 6.0 x 3.5mm, surface mount Momentary Reset Switch SMD <https://www.sparkfun.com/products/8229> (COM-08229) SMD-6.2MM-TALL - 6.2mm square, surface mount Tactile Button - SMD (6mm) <https://www.sparkfun.com/products/12992> Used on SparkFun Digital Sandbox <https://www.sparkfun.com/products/12651> SMD-RIGHT-ANGLE - Right-angle, surface mount Used on SparkFun Block for Intel® Edison - Arduino <https://www.sparkfun.com/products/13036>; PROD_ID: SWCH-08441; SF_SKU: COM-00097
U2 = Arduino_Mega_Shortened:ARDUINO_MEGA_R3_SHORTENED_100MM: Arduino Mega R3 ATmega2560 R3 compatible footprint. SparkFun Products: Arduino Mega 2560 R3 <https://www.sparkfun.com/products/11061>
X2 X4 = SparkFun-Connectors:CONN_03: Multi connection point. Often used as Generic Header-pin footprint for 0.1 inch spaced/style header connections On any of the 0.1 inch spaced packages, you can populate with these: Break Away Headers - Straight <https://www.sparkfun.com/products/116> (PRT-00116) Break Away Male Headers - Right Angle <https://www.sparkfun.com/products/553> (PRT-00553) Female Headers <https://www.sparkfun.com/products/115> (PRT-00115) Break Away Headers - Machine Pin <https://www.sparkfun.com/products/117> (PRT-00117) Break Away Female Headers - Swiss Machine Pin <https://www.sparkfun.com/products/743> (PRT-00743) Stackable Header - 3 Pin (Female, 0.1") <https://www.sparkfun.com/products/13875> (PRT-13875) For SCREWTERMINALS and SPRING TERMINALS visit here: Screw Terimnals on SparkFun.com <https://www.sparkfun.com/search/results?term=Screw+Terminals> (5mm/3.5mm/2.54mm spacing) This device is also useful as a general connection point to wire up your design to another part of your project. Our various solder wires solder well into these plated through hole pads. Hook-Up Wire - Assortment (Stranded, 22 AWG) <https://www.sparkfun.com/products/11375> (PRT-11375) Hook-Up Wire - Assortment (Solid Core, 22 AWG) <https://www.sparkfun.com/products/11367> (PRT-11367) View the entire wire category on our website here <https://www.sparkfun.com/categories/141> Special notes: Molex polarized connector foot print use with SKU : PRT-08232 with associated crimp pins and housings.
X3 = SparkFun-Connectors:CONN_06: Multi connection point. Often used as Generic Header-pin footprint for 0.1 inch spaced/style header connections On any of the 0.1 inch spaced packages, you can populate with these: Break Away Headers - Straight <https://www.sparkfun.com/products/116> (PRT-00116) Break Away Male Headers - Right Angle <https://www.sparkfun.com/products/553> (PRT-00553) Female Headers <https://www.sparkfun.com/products/115> (PRT-00115) Break Away Headers - Machine Pin <https://www.sparkfun.com/products/117> (PRT-00117) Break Away Female Headers - Swiss Machine Pin <https://www.sparkfun.com/products/743> (PRT-00743) Arduino Stackable Header - 6 Pin <https://www.sparkfun.com/products/9280> (PRT-09280) For SCREWTERMINALS and SPRING TERMINALS visit here: Screw Terimnals on SparkFun.com <https://www.sparkfun.com/search/results?term=Screw+Terminals> (5mm/3.5mm/2.54mm spacing) This device is also useful as a general connection point to wire up your design to another part of your project. Our various solder wires solder well into these plated through hole pads. Hook-Up Wire - Assortment (Stranded, 22 AWG) <https://www.sparkfun.com/products/11375> (PRT-11375) Hook-Up Wire - Assortment (Solid Core, 22 AWG) <https://www.sparkfun.com/products/11367> (PRT-11367) View the entire wire category on our website here <https://www.sparkfun.com/categories/141>; PROD_ID: CONN-08437
Y1 = SmartPrj:RESONATOR

## Net classes
1 power: width 0.61 mm, drill 0.406 mm, clearance 0.203 mm
2 gnd: width 0.305 mm, drill 0.406 mm, clearance 0.203 mm
3 power usb: width 0.508 mm, drill 0.406 mm, clearance 0.203 mm